# Altium project DIGITAL_CLOCK.PrjPcb
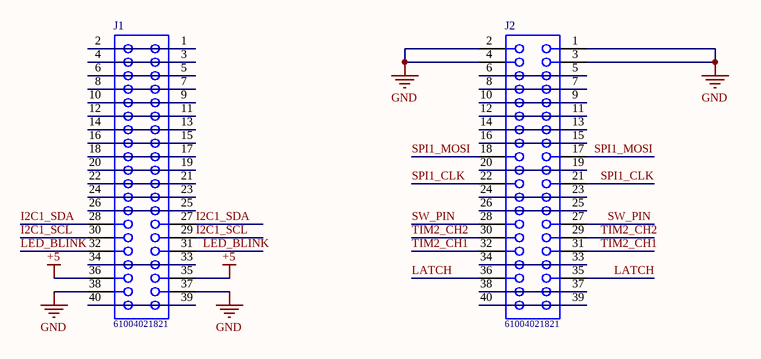
[diagram p0: MCU.SchDoc]
3 sheets, 22 parts. Net scope: global (net labels, ports and power ports of the same name join across sheets).
Board files: PCB1.PcbDoc, PCB2.PcbDoc
Sheets:
  MCU.SchDoc
  Peripherials.SchDoc
  Power_Supply.SchDoc

## Sheet MCU.SchDoc
size A4; SheetNumber: 1; SheetTotal: 3

### Parts
J1  61004021821  [61004021821]
J2  61004021821  [61004021821]

### Nets
+5: J1.35 J1.36
GND: J1.37 J1.38 J2.1 J2.2 J2.3 J2.4
I2C1_SCL: J1.29 J1.30
I2C1_SDA: J1.27 J1.28
LATCH: J2.35 J2.36
LED_BLINK: J1.31 J1.32
SPI1_CLK: J2.21 J2.22
SPI1_MOSI: J2.17 J2.18
SW_PIN: J2.27 J2.28
TIM2_CH1: J2.31 J2.32
TIM2_CH2: J2.29 J2.30
NetJ1_1: J1.1 J1.2
NetJ1_3: J1.3 J1.4
NetJ1_5: J1.5 J1.6
NetJ1_7: J1.7 J1.8
NetJ1_9: J1.9 J1.10
NetJ1_11: J1.11 J1.12
NetJ1_13: J1.13 J1.14
NetJ1_15: J1.15 J1.16
NetJ1_17: J1.17 J1.18
NetJ1_19: J1.19 J1.20
NetJ1_21: J1.21 J1.22
NetJ1_23: J1.23 J1.24
NetJ1_25: J1.25 J1.26
NetJ1_33: J1.33 J1.34
NetJ1_39: J1.39 J1.40
NetJ2_5: J2.5 J2.6
NetJ2_7: J2.7 J2.8
NetJ2_9: J2.9 J2.10
NetJ2_11: J2.11 J2.12
NetJ2_13: J2.13 J2.14
NetJ2_15: J2.15 J2.16
NetJ2_19: J2.19 J2.20
NetJ2_23: J2.23 J2.24
NetJ2_25: J2.25 J2.26
NetJ2_33: J2.33 J2.34
NetJ2_37: J2.37 J2.38
NetJ2_39: J2.39 J2.40

### Library data of the parts
J1 J2 = 61004021821: WR-PHD Socket Header, SMT, pitch 2.54mm, Dual Row, Vertical, 40p; Manufacturer: Wurth Elektronik; Pin Number: 40; Rated Current: 3A; Working Voltage: 250VAC; Withstanding Voltage: 600VAC; Contact Resistance: 20mOhm; ComponentLink1Description: Manufacturer; ComponentLink1URL: http://www.we-online.de; ComponentLink2Description: Datasheet; ComponentLink2URL: https://www.we-online.com/catalog/datasheet/61004021821.pdf; Manufacturer Part Number: 61004021821; Published Date: May 2020; Pitch: 2.54mm; Operating Temperature: -40 to +105degC; Mounting Technology: SMT; Packaging: Tube; Gender: Socket Header; Row Number: Dual; Orientation: Vertical

## Sheet Peripherials.SchDoc
size A4; SheetNumber: 2; SheetTotal: 3
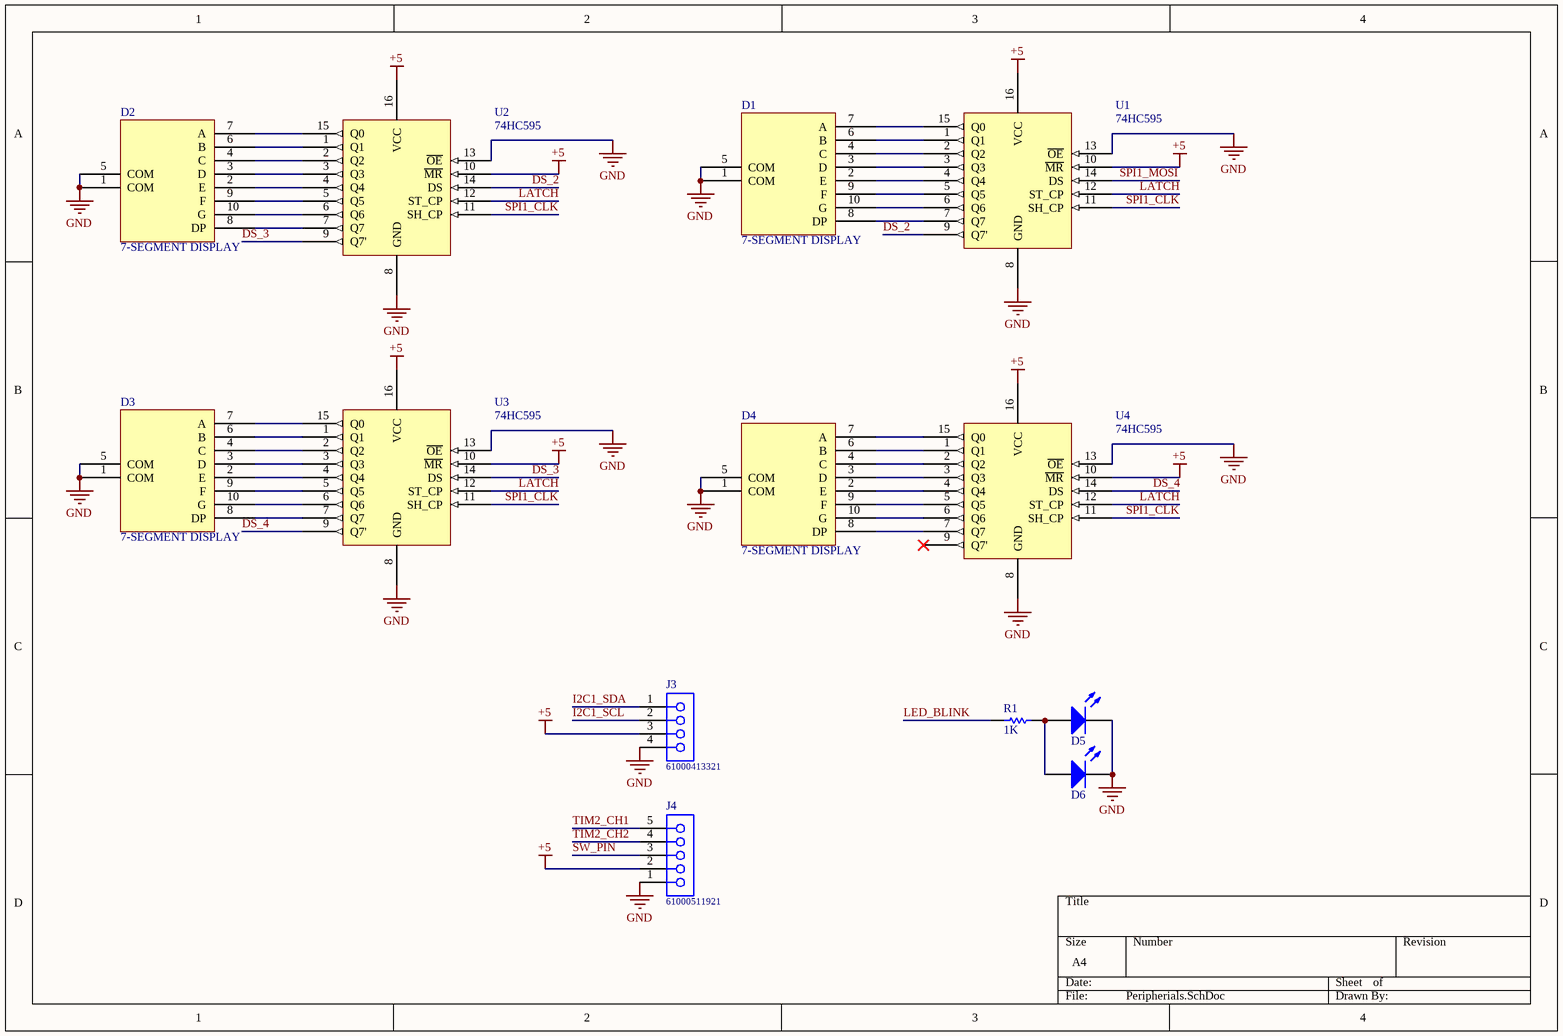
[diagram p1: Peripherials.SchDoc]

### Parts
D1  7-SEGMENT DISPLAY  [7-SEGMENT 1.8INCH]
D2  7-SEGMENT DISPLAY  [7-SEGMENT 1.8INCH]
D3  7-SEGMENT DISPLAY  [7-SEGMENT 1.8INCH]
D4  7-SEGMENT DISPLAY  [7-SEGMENT 1.8INCH]
D5  LED  [LED-3mm]  (value not drawn)
D6  LED  [LED-3mm]  (value not drawn)
J3  61000413321  [61000413321]
J4  61000511921  [61000511921]
R1  value 1K  [RES-SM-0805]  (hidden comment: RESISTOR SMD)
U1  74HC595  [SOIC-16]
U2  74HC595  [SOIC-16]
U3  74HC595  [SOIC-16]
U4  74HC595  [SOIC-16]

### Nets
+5: J3.3 J4.2 U1.10(~{MR}) U1.16(VCC) U2.10(~{MR}) U2.16(VCC) U3.10(~{MR}) U3.16(VCC) U4.10(~{MR}) U4.16(VCC)
GND: D1.1(COM) D1.5(COM) D2.1(COM) D2.5(COM) D3.1(COM) D3.5(COM) D4.1(COM) D4.5(COM) D5.2(K) D6.2(K) J3.4 J4.1 U1.8(GND) U1.13(~{OE}) U2.8(GND) U2.13(~{OE}) U3.8(GND) U3.13(~{OE}) U4.8(GND) U4.13(~{OE})
DS_2: U1.9(Q7') U2.14(DS)
DS_3: U2.9(Q7') U3.14(DS)
DS_4: U3.9(Q7') U4.14(DS)
I2C1_SCL: J3.2
I2C1_SDA: J3.1
LATCH: U1.12(ST_CP) U2.12(ST_CP) U3.12(ST_CP) U4.12(ST_CP)
LED_BLINK: R1.1
SPI1_CLK: U1.11(SH_CP) U2.11(SH_CP) U3.11(SH_CP) U4.11(SH_CP)
SPI1_MOSI: U1.14(DS)
SW_PIN: J4.3
TIM2_CH1: J4.5
TIM2_CH2: J4.4
NetD1_2: D1.2(E) U1.4(Q4)
NetD1_3: D1.3(D) U1.3(Q3)
NetD1_4: D1.4(C) U1.2(Q2)
NetD1_6: D1.6(B) U1.1(Q1)
NetD1_7: D1.7(A) U1.15(Q0)
NetD1_8: D1.8(DP) U1.7(Q7)
NetD1_9: D1.9(F) U1.5(Q5)
NetD1_10: D1.10(G) U1.6(Q6)
NetD2_2: D2.2(E) U2.4(Q4)
NetD2_3: D2.3(D) U2.3(Q3)
NetD2_4: D2.4(C) U2.2(Q2)
NetD2_6: D2.6(B) U2.1(Q1)
NetD2_7: D2.7(A) U2.15(Q0)
NetD2_8: D2.8(DP) U2.7(Q7)
NetD2_9: D2.9(F) U2.5(Q5)
NetD2_10: D2.10(G) U2.6(Q6)
NetD3_2: D3.2(E) U3.4(Q4)
NetD3_3: D3.3(D) U3.3(Q3)
NetD3_4: D3.4(C) U3.2(Q2)
NetD3_6: D3.6(B) U3.1(Q1)
NetD3_7: D3.7(A) U3.15(Q0)
NetD3_8: D3.8(DP) U3.7(Q7)
NetD3_9: D3.9(F) U3.5(Q5)
NetD3_10: D3.10(G) U3.6(Q6)
NetD4_2: D4.2(E) U4.4(Q4)
NetD4_3: D4.3(D) U4.3(Q3)
NetD4_4: D4.4(C) U4.2(Q2)
NetD4_6: D4.6(B) U4.1(Q1)
NetD4_7: D4.7(A) U4.15(Q0)
NetD4_8: D4.8(DP) U4.7(Q7)
NetD4_9: D4.9(F) U4.5(Q5)
NetD4_10: D4.10(G) U4.6(Q6)
NetD5_1: D5.1(A) D6.1(A) R1.2

Not connected (* = marked no-connect by the designer): U4 9(Q7')*

### Library data of the parts
D1-D4 = 7-SEGMENT
J3 = 61000413321: WR-PHD Socket Header, SMT, pitch 2.54mm, Single Row, Vertical, 4p; Manufacturer: Wurth Elektronik; Pin Number: 4; Rated Current: 3A; Working Voltage: 250VAC; Withstanding Voltage: 500VAC; Contact Resistance: 20mOhm; ComponentLink1Description: Manufacturer; ComponentLink1URL: http://www.we-online.de; ComponentLink2Description: Datasheet; ComponentLink2URL: https://www.we-online.com/catalog/datasheet/61000413321.pdf; Manufacturer Part Number: 61000413321; Published Date: May 2020; Pitch: 2.54mm; Operating Temperature: -40 to +125degC; Mounting Technology: SMT; Packaging: Tube; Gender: Socket Header; Row Number: Single; Orientation: Vertical
J4 = 61000511921: WR-PHD Socket Header, SMT, pitch 2.54mm, Single Row, Vertical, 5p; Manufacturer: Wurth Elektronik; Pin Number: 5; Rated Current: 3A; Working Voltage: 250VAC; Withstanding Voltage: 500VAC; Contact Resistance: 20mOhm; ComponentLink1Description: Manufacturer; ComponentLink1URL: http://www.we-online.de; ComponentLink2Description: Datasheet; ComponentLink2URL: https://www.we-online.com/catalog/datasheet/61000511921.pdf; Manufacturer Part Number: 61000511921; Published Date: May 2020; Pitch: 2.54mm; Operating Temperature: -40 to +125degC; Mounting Technology: SMT; Packaging: Tube; Gender: Socket Header; Row Number: Single; Orientation: Vertical
R1 = RESISTOR SMD: Resistor
U1-U4 = 74HC595: 8-Bit Serial-Input/Serial orParallel-Output ShiftRegister with Latched3-State Outputs

## Sheet Power_Supply.SchDoc
size A4; SheetNumber: 3; SheetTotal: 3
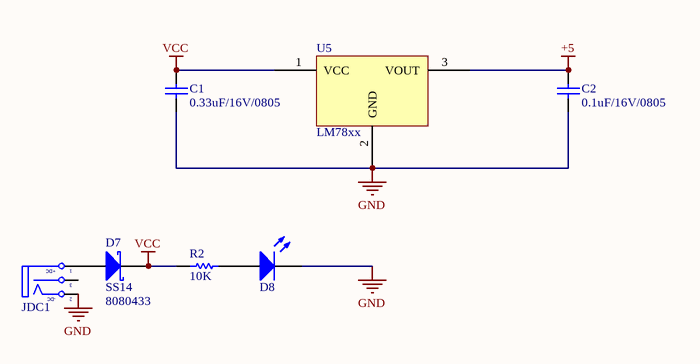
[diagram p2: Power_Supply.SchDoc]

### Parts
C1  value 0.33uF/16V/0805  [CAP-SM-0805]  (hidden comment: Cap Non-Pol SMD)
C2  value 0.1uF/16V/0805  [CAP-SM-0805]  (hidden comment: Cap Non-Pol SMD)
D7  Supplier Part Number 1: SS14  Supplier Part Number 2: 8080433  [SS34]  (hidden comment: D Schottky)
D8  LED SMD  [LED_0805_Blue]  (value not drawn)
JDC1  Jack DC  [DC-IN]  (value not drawn)
R2  value 10K  [RES-SM-0805]  (hidden comment: RESISTOR SMD)
U5  LM78xx  [DPAK228P1014X239-3N]

### Nets
+5: C2.2 U5.3(VOUT)
GND: C1.1 C2.1 D8.2(K) JDC1.2(TN) U5.2(GND)
VCC: C1.2 D7.K R2.1 U5.1(VCC)
NetD7_A: D7.A JDC1.1(T)
NetD8_1: D8.1(A) R2.2

Not connected (* = marked no-connect by the designer): JDC1 3(S)

### Notes on the sheet
- (in symbol Jack DC) +DC; -DC

### Library data of the parts
C1 C2 = Cap Non-Pol SMD: Capacitor
D7 = D Schottky: Schottky Diode; Published: 8-Jun-2000; LatestRevisionDate: 17-Jul-2002; LatestRevisionNote: Re-released for DXP Platform.; PackageReference: SMB; Publisher: Altium Limited; PackageDescription: DO-214-AA/SMB; 2 C-Bend Leads; Body 5.3 x 3.6 mm, inc. leads (LxW); Code_JEDEC: DO-214-AA; Supplier 1: Arrow Electronics; Supplier 2: RSComponents
D8 = LED SMD: LED
JDC1 = Jack DC: Jack DC input; Value: Jac DC
R2 = RESISTOR SMD: Resistor

## Nets that join several sheets
+5: MCU (J1.35 J1.36), Peripherials (10 pins), Power_Supply (C2.2 U5.3)
GND: MCU (6 pins), Peripherials (20 pins), Power_Supply (5 pins)
I2C1_SCL: MCU (J1.29 J1.30), Peripherials (J3.2)
I2C1_SDA: MCU (J1.27 J1.28), Peripherials (J3.1)
LATCH: MCU (J2.35 J2.36), Peripherials (U1.12 U2.12 U3.12 U4.12)
LED_BLINK: MCU (J1.31 J1.32), Peripherials (R1.1)
SPI1_CLK: MCU (J2.21 J2.22), Peripherials (U1.11 U2.11 U3.11 U4.11)
SPI1_MOSI: MCU (J2.17 J2.18), Peripherials (U1.14)
SW_PIN: MCU (J2.27 J2.28), Peripherials (J4.3)
TIM2_CH1: MCU (J2.31 J2.32), Peripherials (J4.5)
TIM2_CH2: MCU (J2.29 J2.30), Peripherials (J4.4)